# EAGLE design DANI-PROJECT (EAGLE 8.6.3)
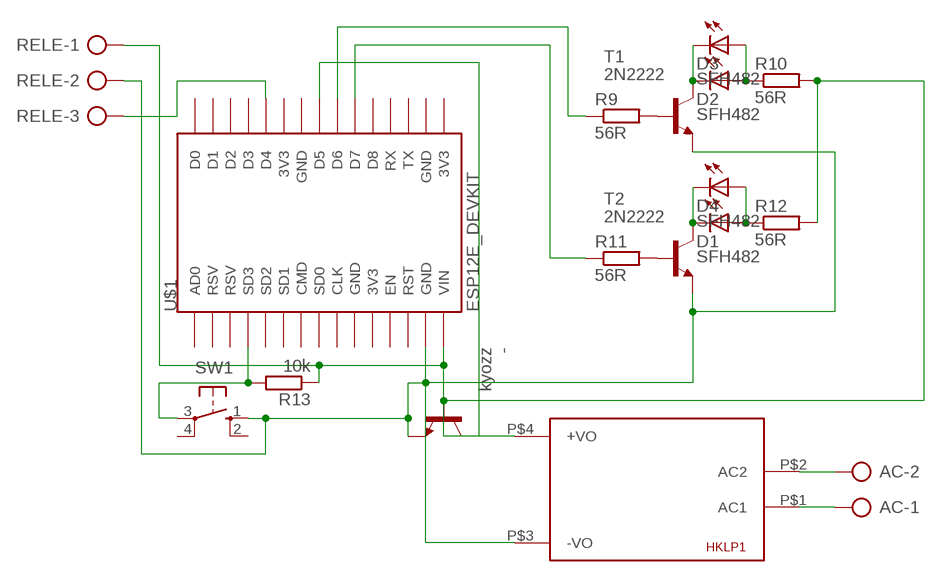
[diagram p0: schematic, sheet 1]

## Parts
-  kyozz  BC489  [TO92-EBC]
AC  AK500/2-H  [AK500/2-H]
D1  SFH482  [SFH482]
D2  SFH482  [SFH482]
D3  SFH482  [SFH482]
D4  SFH482  [SFH482]
HKLP1  HKLPM01  [HKLPM01]
R9  56R  R-EU_0207/7  [0207/7]
R10  56R  R-EU_0207/7  [0207/7]
R11  56R  R-EU_0207/7  [0207/7]
R12  56R  R-EU_0207/7  [0207/7]
R13  10k  R-EU_0207/7  [0207/7]
RELE  AK500/3-H  [AK500/3-H]
SW1  10-XX  [B3F-10XX]
T1  2N2222  [TO18]
T2  2N2222  [TO18]
U$1  ESP12E_DEVKIT  [ESP12E_DEVKIT]

## Nets
N$1: AC.2 HKLP1.P$2(AC2)
N$2: AC.1 HKLP1.P$1(AC1)
N$17: R13.2 SW1.3(P) U$1.SD3
N$18: D1.K(C) D4.K(C) T2.3(C)
N$19: R11.2 T2.2(B)
N$20: R9.2 T1.2(B)
N$21: D2.A D3.A R10.1
N$22: D2.K(C) D3.K(C) T1.3(C)
N$23: -.B HKLP1.P$4(+VO) R10.2 R12.2 R13.1 RELE.1 U$1.VIN
N$24: D1.A D4.A R12.1
N$26: R9.1 U$1.D6
N$27: R11.1 U$1.D7
N$28: -.E HKLP1.P$3(-VO) RELE.2 SW1.1(S) T1.1(E) T2.1(E) U$1.GND@1(GND)
N$29: -.C U$1.D5
N$31: RELE.3 U$1.D4
Unconnected: SW1.2(S1) SW1.4(P1) U$1.3V3@0(3V3) U$1.3V3@1(3V3) U$1.3V3@2(3V3) U$1.AD0 U$1.CLK U$1.CMD U$1.D0 U$1.D1 U$1.D2 U$1.D3 U$1.D8 U$1.EN U$1.GND@0(GND) U$1.GND@2(GND) U$1.GND@3(GND) U$1.RST U$1.RSV@0(RSV) U$1.RSV@1(RSV) U$1.RX U$1.SD0 U$1.SD1 U$1.SD2 U$1.TX

## Library data of the parts
- = transistor-npn:BC489*: NPN Transistor
AC = con-ptr500:AK500/2-H: CONNECTOR Aug. 2004 / PTR Meßtechnik: Die Bezeichnung der Serie AK505 wurde geändert. Es handelt sich hierbei um AK500 in horizontaler Ausführung.; OC_FARNELL: unknown; OC_NEWARK: unknown
D1-D4 = led:SFH482: IR LED infrared emitting diode, Infineon
HKLP1 = HKLPM01:HKLPM01
R9-R13 = resistor:R-EU_: RESISTOR, European symbol
RELE = con-ptr500:AK500/3-H: CONNECTOR Aug. 2004 / PTR Meßtechnik: Die Bezeichnung der Serie AK505 wurde geändert. Es handelt sich hierbei um AK500 in horizontaler Ausführung.; OC_FARNELL: unknown; OC_NEWARK: unknown
SW1 = botton:10-XX: OMRON SWITCH
T1 T2 = transistor:2N2222: NPN TRANSISTOR
U$1 = ESP12E_DEVKIT:ESP12E_DEVKIT: ESP12E DEVKIT BOARD

## Net classes
0 default: width 0.75 mm, drill 0.75 mm, clearance 0.75 mm

## Board
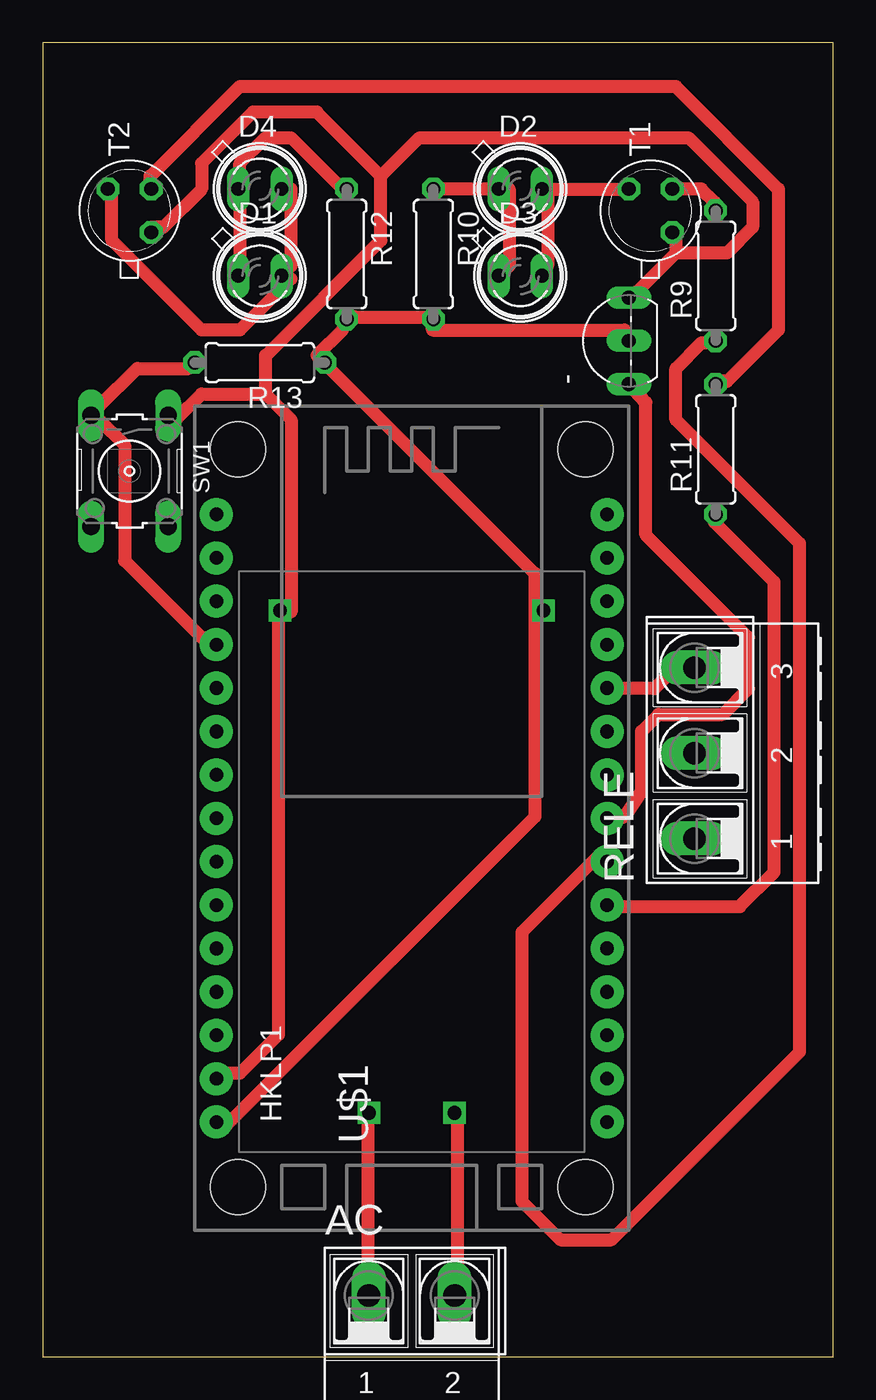
[diagram p1: board, top side]
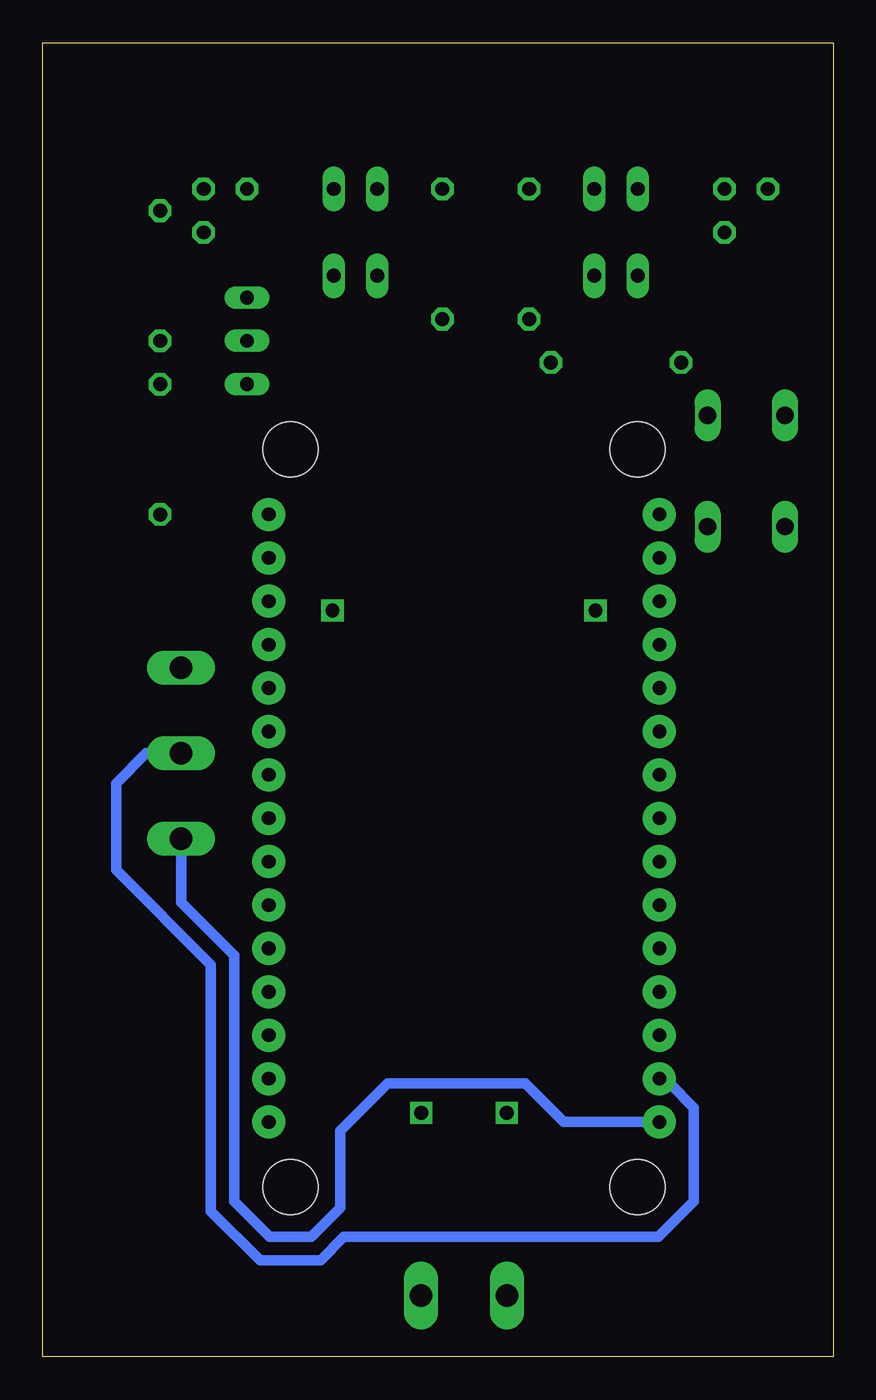
[diagram p2: board, bottom side, seen from below]

Size 46.24 x 76.91 mm. Coordinates in mm from the lower left corner, seen from the top.
Outline: 0,0 46.24,0 46.24,76.91 0,76.91 0,0
Copper layers (1*16): Top 0.035mm / dielectric 1.5mm / Bottom 0.035mm
Design rules "default": minimum track width 6mil, minimum drill 0.35mm, track to track 6mil, track to pad 6mil, pad to pad 6mil, via to via 6mil, smd to smd 6mil, copper to edge 40mil, drill to drill 6mil, minimum pad ring 10mil, minimum via ring 8mil, stop-mask expansion 4mil, vias tented up to drill 0mil, thermal gap 10mil

### Footprints (pad centres in the part's own frame; a part is rotated, then mirrored left to right if it is on the bottom)
TO92-EBC = drill 0.813 long: B 0,-1.27; C -2.54,-1.27; E 2.54,-1.27
AK500/2-H = drill 1.321 long: 1 -2.515,0; 2 2.515,0
SFH482 = drill 0.813 long: A -1.27,0; K 1.27,0
HKLPM01 = drill 0.8 square: P$1 -14.7,2.5; P$2 -14.7,-2.5; P$3 14.7,7.7; P$4 14.7,-7.7
0207/7 = drill 0.813 octagon: 1 -3.81,0; 2 3.81,0
AK500/3-H = drill 1.321 long: 1 -5.004,0; 2 0,0; 3 5.004,0
B3F-10XX = drill 1.016 long: 1 -3.251,2.261; 2 3.251,2.261; 3 -3.251,-2.261; 4 3.251,-2.261
TO18 = drill 0.813 octagon: 1 -1.27,-1.27; 2 1.27,-1.27; 3 1.27,1.27
ESP12E_DEVKIT = drill 0.8 pad 1.93: 3V3@0 -11.43,-7.62; 3V3@1 11.43,5.08; 3V3@2 11.43,-17.78; AD0 -11.43,17.78; CLK -11.43,-2.54; CMD -11.43,2.54; D0 11.43,17.78; D1 11.43,15.24; D2 11.43,12.7; D3 11.43,10.16; D4 11.43,7.62; D5 11.43,0; D6 11.43,-2.54; D7 11.43,-5.08; D8 11.43,-7.62; EN -11.43,-10.16; GND@0 -11.43,-5.08; GND@1 -11.43,-15.24; GND@2 11.43,2.54; GND@3 11.43,-15.24; RST -11.43,-12.7; RSV@0 -11.43,15.24; RSV@1 -11.43,12.7; RX 11.43,-10.16; SD0 -11.43,0; SD1 -11.43,5.08; SD2 -11.43,7.62; SD3 -11.43,10.16; TX 11.43,-12.7; VIN -11.43,-17.78 | hole 3.2: -10.16,21.59; 10.16,21.59; 10.16,-21.59; -10.16,-21.59

### Placement (x,y rotation side)
-  33.02,59.46 90 top
AC  21.59,3.58 0 top
D1  12.7,63.27 0 top
D2  27.94,68.35 0 top
D3  27.94,63.27 0 top
D4  12.7,68.35 0 top
HKLP1  21.59,28.98 90 top
R9  39.37,63.27 90 top
R10  22.86,64.54 270 top
R11  39.37,53.11 90 top
R12  17.78,64.54 270 top
R13  12.7,58.19 180 top
RELE  38.14,35.33 90 top
SW1  5.08,51.84 270 top
T1  35.56,67.08 90 top
T2  5.08,67.08 90 top
U$1  21.59,31.52 0 top

### Tracks (layer width: path | path; a pad name or v marks a point on that pad's centre or on a via)
N$1
  Top 0.75: HKLP1.P$2 24.29,14.35 24.29,3.85 AC.2
N$2
  Top 0.75: HKLP1.P$1 19.04,14.35 19.04,3.85 AC.1
N$17
  Top 0.75: R13.2 8.54,57.85 5.54,57.85 3.29,55.6 SW1.3 3.29,54.85 4.79,53.35 4.79,46.6 9.29,42.1 10.04,42.1 U$1.SD3
N$18
  Top 0.75: T2.3 4.04,68.35 4.04,65.35 9.29,60.1 11.54,60.1 14.54,63.1 D1.K 14.54,63.85 14.54,68.35 D4.K
N$19
  Top 0.75: R11.2 39.29,57.1 40.04,57.1 43.04,60.1 43.04,68.35 37.04,74.35 11.54,74.35 6.29,69.1 6.29,68.35 T2.2
N$20
  Top 0.75: T1.2 38.54,68.35 39.29,67.6 R9.2
N$21
  Top 0.75: 22.79,68.35 R10.1 D2.A 27.29,68.35 27.29,63.85 D3.A
N$22
  Top 0.75: 29.54,68.35 29.54,63.85 D3.K | 29.54,68.35 T1.3 | 29.54,68.35 D2.K
N$23
  Top 0.75: 28.79,43.6 28.79,45.85 16.79,57.85 R13.1 16.04,58.6 17.54,60.1 R12.2 18.29,60.85 22.79,60.85 R10.2 22.79,60.1 34.04,60.1 -.B | 28.79,43.6 28.79,31.6 10.79,13.6 U$1.VIN | 28.79,43.6 HKLP1.P$4
  Bottom 0.61: U$1.VIN 15.75,13.74 18,15.99 26.06,15.99 28.83,13.22 28.83,8.72 30.54,7.01 32.96,7.01 35.04,9.09 35.04,23.49 38.14,26.59 RELE.1
N$24
  Top 0.75: 11.54,68.35 11.54,63.85 D1.A | 11.54,68.35 11.54,69.85 13.04,71.35 14.54,71.35 17.54,68.35 R12.1 | 11.54,68.35 D4.A
N$26
  Top 0.75: R9.1 39.29,59.35 38.54,59.35 37.04,57.85 37.04,54.85 44.29,47.6 44.29,17.85 33.29,6.85 30.29,6.85 28.04,9.1 28.04,24.85 32.54,29.35 U$1.D6
N$27
  Top 0.75: R11.1 39.29,48.85 42.79,45.35 42.79,28.35 40.79,26.35 33.29,26.35 U$1.D7
N$28
  Top 0.75: 37.04,64.6 34.79,62.35 -.E | 37.04,64.6 37.04,65.35 T1.1 | 13.04,56.35 14.54,54.85 14.54,43.6 HKLP1.P$3 13.79,43.6 13.79,18.85 11.54,16.6 10.79,16.6 U$1.GND@1 | 13.04,56.35 9.29,56.35 7.79,54.85 SW1.1 | 19.79,69.1 16.04,72.85 12.29,72.85 9.29,69.85 9.29,68.35 7.04,66.1 6.29,66.1 T2.1 | 19.79,69.1 19.79,65.35 13.04,58.6 13.04,56.35 | 37.04,64.6 40.04,64.6 41.54,66.1 41.54,67.6 37.79,71.35 22.04,71.35 19.79,69.1
  Bottom 0.61: U$1.GND@1 9.87,15.99 9.55,15.99 8.14,14.58 8.14,9.09 10.22,7.01 28.62,7.01 29.98,5.65 33.52,5.65 36.4,8.53 36.4,22.93 41.95,28.48 41.95,33.56 40.18,35.33 RELE.2
N$29
  Top 0.75: -.C 35.29,55.85 35.29,48.1 41.29,42.1 41.29,39.1 39.79,37.6 36.04,37.6 35.04,36.6 35.04,33.1 34.04,31.6 33.29,31.6 U$1.D5
N$31
  Top 0.75: U$1.D4 33.29,39.1 35.79,39.1 37.04,40.35 RELE.3